# EAGLE design zigbee-dimmer (EAGLE 7.7.0)
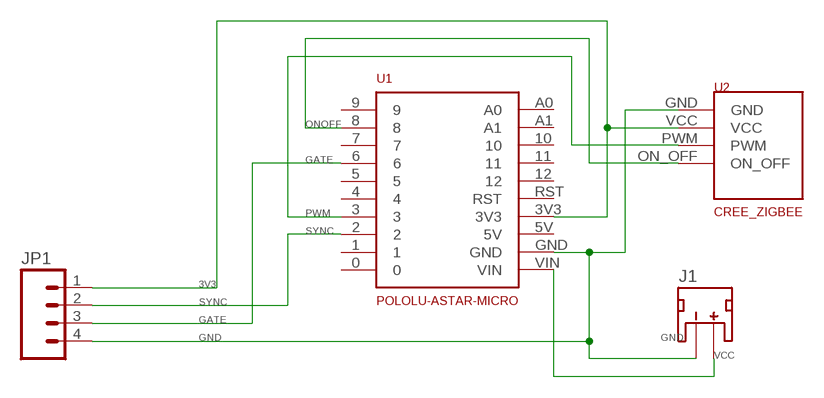
[diagram p0: schematic, sheet 1]

## Parts
J1  JST_2MM_MALE  [JST-2-SMD]
JP1  DIMMER_PINSSMD_180  [1X04-SMD]
U1  POLOLU-ASTAR-MICRO  [POLOLU-ASTAR-MICRO]
U2  CREE_ZIGBEE  [CREE-ZIGBEE]

## Nets
3V3: JP1.1 U1.3V3 U2.VCC
GATE: JP1.3 U1.6
GND: J1.1(-) JP1.4 U1.GND U2.GND
ONOFF: U1.8 U2.ON_OFF
PWM: U1.3 U2.PWM
SYNC: JP1.2 U1.2
VCC: J1.2(+) U1.VIN
Unconnected: J1.NC1(PAD1) J1.NC2(PAD2) U1.0 U1.1 U1.4 U1.5 U1.7 U1.9 U1.10 U1.11 U1.12 U1.A0 U1.A1 U1.RST

## Power pins joined to a net without a drawn wire
5V: U1.5V

## Library data of the parts
J1 = SparkFun-Connectors:JST_2MM_MALE: Mates to single-cell LiPo batteries. CONN-11443 Now with smashable polarity marks!; BTM_NEG: -; BTM_POS: +; PROD_ID: CONN-11443; TOP_NEG: -; TOP_POS: +
JP1 = zigbee-dimmer-libs:DIMMER_PINS: Header 4 Standard 4-pin 0.1" header. Use with straight break away headers (SKU : PRT-00116), right angle break away headers (PRT-00553), swiss pins (PRT-00743), machine pins (PRT-00117), and female headers (PRT-00115). Molex polarized connector foot print use with SKU : PRT-08231 with associated crimp pins and housings. 1MM SMD Version SKU: PRT-10208
U1 = zigbee-dimmer-libs:POLOLU-ASTAR-MICRO
U2 = zigbee-dimmer-libs:CREE_ZIGBEE

## Board
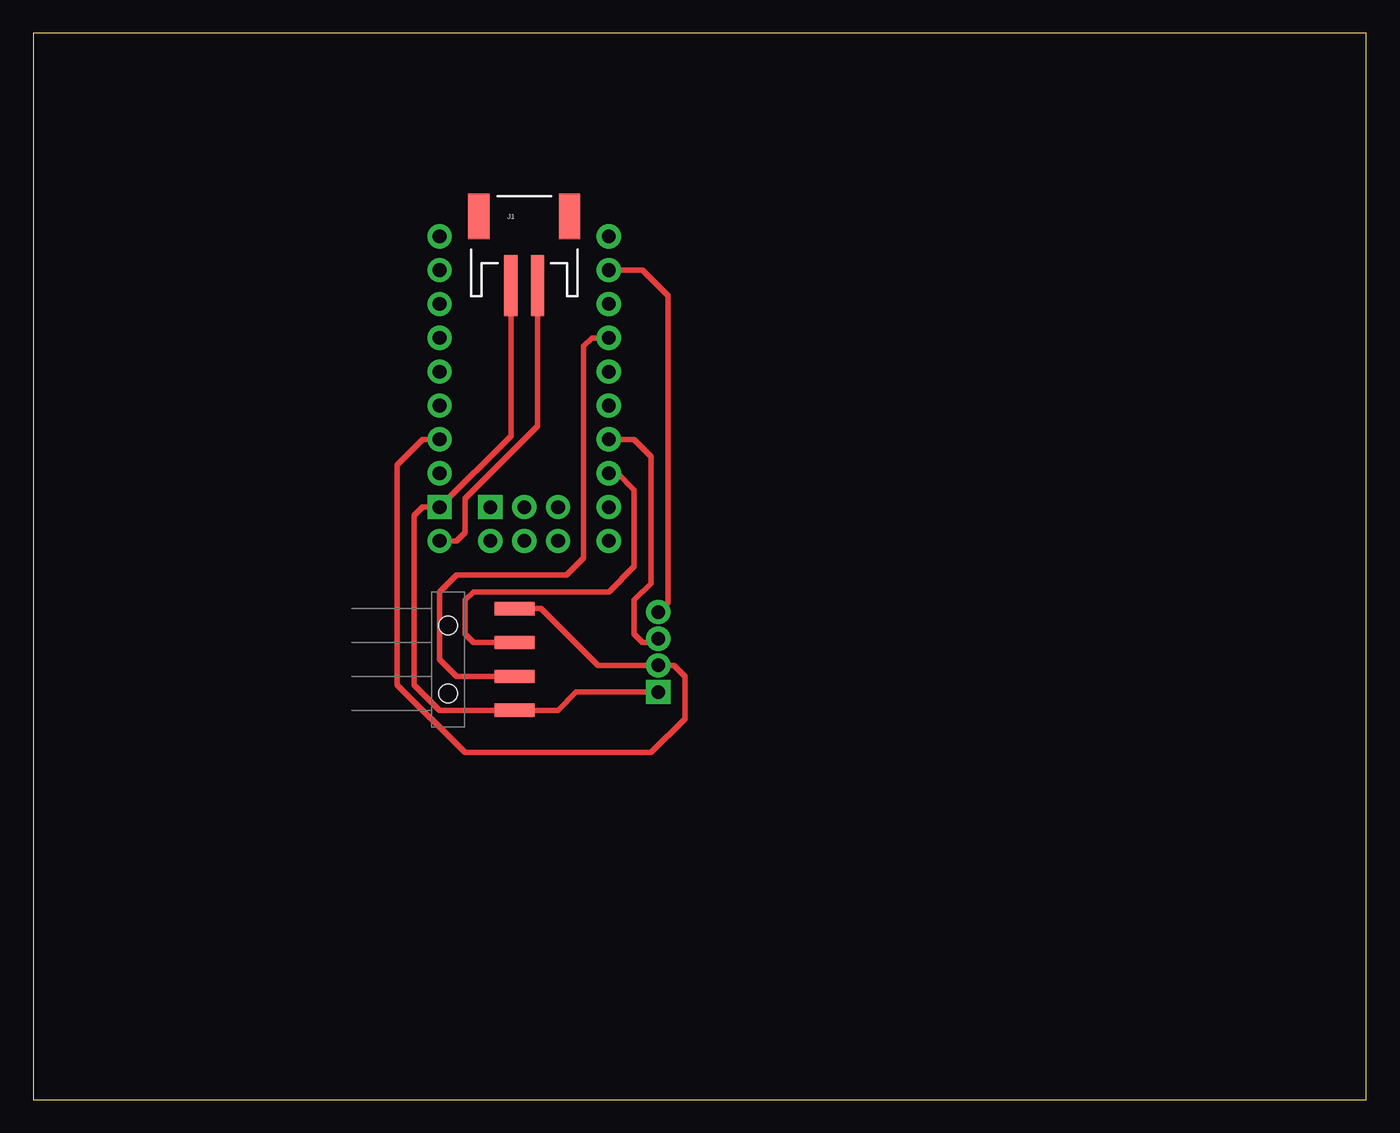
[diagram p1: board, top side]
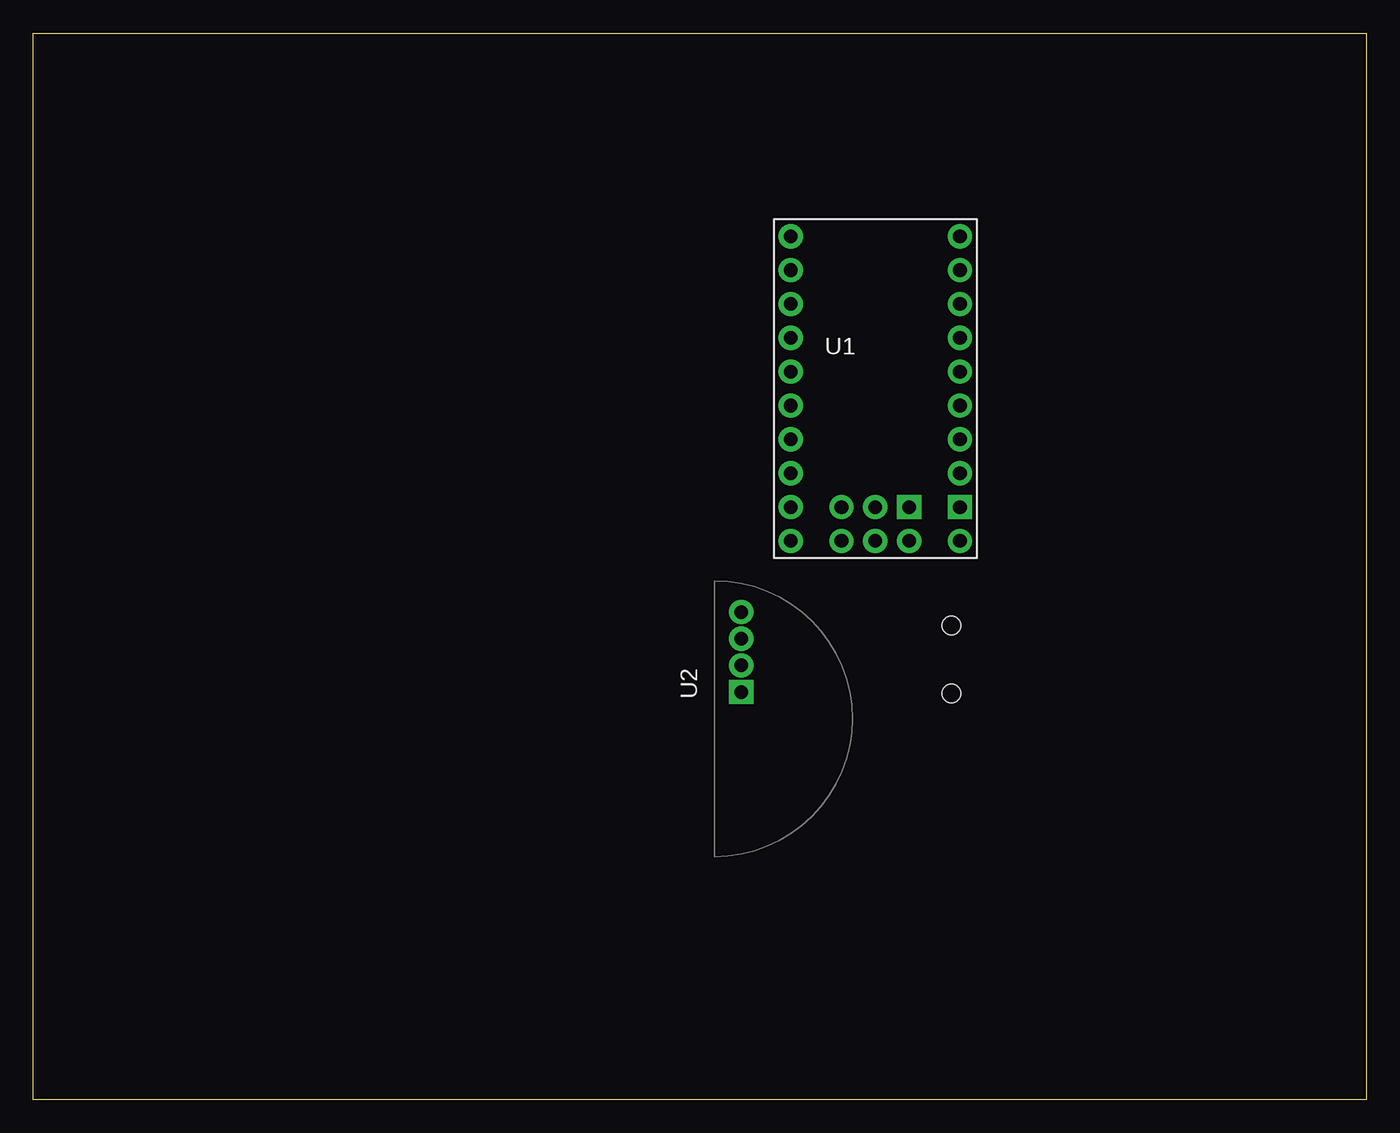
[diagram p2: board, bottom side, seen from below]

Size 100 x 80 mm. Coordinates in mm from the lower left corner, seen from the top.
Outline: 0,0 100,0 100,80 0,80 0,0
Copper layers 1+16: Top 0.035mm / dielectric 1.5mm / Bottom 0.035mm
Design rules "dru_16mils": minimum track width 10mil, minimum drill 0.8mm, track to track 16mil, track to pad 16mil, pad to pad 16mil, via to via 16mil, smd to smd 16mil, copper to edge 16mil, drill to drill 16mil, minimum pad ring 0.1mm, minimum via ring 0.8mm, stop-mask expansion 4mil, vias tented up to drill 0mil, thermal gap 1mm

### Footprints (pad centres in the part's own frame; a part is rotated, then mirrored left to right if it is on the bottom)
JST-2-SMD = smd 1 x 4.6: 1 -1,-3.7; 2 1,-3.7 | smd 1.6 x 3.4: NC1 -3.4,1.5; NC2 3.4,1.5
1X04-SMD = smd 1 x 3: 1 -3.81,5; 2 -1.27,5; 3 1.27,5; 4 3.81,5 | hole 1.4: -2.54,0; 2.54,0
POLOLU-ASTAR-MICRO = drill 1.016: 0 -6.35,-11.43; 1 -6.35,-8.89; 2 -6.35,-6.35; 3 -6.35,-3.81; 3V3 6.35,-3.81; 4 -6.35,-1.27; 5 -6.35,1.27; 5V 6.35,-6.35; 6 -6.35,3.81; 7 -6.35,6.35; 8 -6.35,8.89; 9 -6.35,11.43; 10 6.35,6.35; 11 6.35,3.81; 12 6.35,1.27; A0 6.35,11.43; A1 6.35,8.89; P$11 -2.54,-8.89; P$12 -2.54,-11.43; P$13 0,-8.89; P$14 0,-11.43; P$15 2.54,-11.43; RST 6.35,-1.27; VIN 6.35,-11.43 | drill 1.016 square: GND 6.35,-8.89; P$16 2.54,-8.89
CREE-ZIGBEE = drill 1.016 square: GND -2,2 | drill 1.016: ON_OFF -8,2; PWM -6,2; VCC -4,2

### Placement (x,y rotation side)
J1  36.83,64.77 0 top
JP1  31.11,33.02 270 top
U1  36.83,53.34 0 bottom
U2  48.9,28.57 270 bottom

### Tracks (layer width: path | path; a pad name or v marks a point on that pad's centre or on a via)
3V3
  Top 0.406: U1.3V3 29.21,49.53 27.3,47.62 27.3,31.11 32.38,26.04 46.35,26.04 48.9,28.57 48.9,31.75 48.07,32.58 U2.VCC 42.35,32.58 38.1,36.83 JP1.1
GATE
  Top 0.406: JP1.3 31.75,31.75 30.48,33.02 30.48,38.1 31.75,39.37 40.01,39.37 41.27,40.64 41.27,56.52 41.91,57.15 U1.6
GND
  Top 0.406: J1.1 35.83,49.8 U1.GND 29.21,44.45 28.57,43.81 28.57,31.11 30.48,29.21 JP1.4 39.37,29.21 40.73,30.57 U2.GND
ONOFF
  Top 0.406: U1.8 45.72,62.23 47.62,60.33 47.62,37.3 U2.ON_OFF
PWM
  Top 0.406: U1.3 45.09,49.53 46.35,48.26 46.35,38.73 45.09,37.47 45.09,34.92 45.72,34.29 46.61,34.29 U2.PWM
SYNC
  Top 0.406: JP1.2 33.02,34.29 32.38,34.92 32.38,37.47 33.02,38.1 43.18,38.1 45.09,40.01 45.09,45.72 43.81,46.99 U1.2
VCC
  Top 0.406: J1.2 37.83,50.53 32.38,45.09 32.38,42.55 31.75,41.91 U1.VIN